# EAGLE design axiom_beta_shield_debug (EAGLE 7.7.0)
Assembly variants: Beta
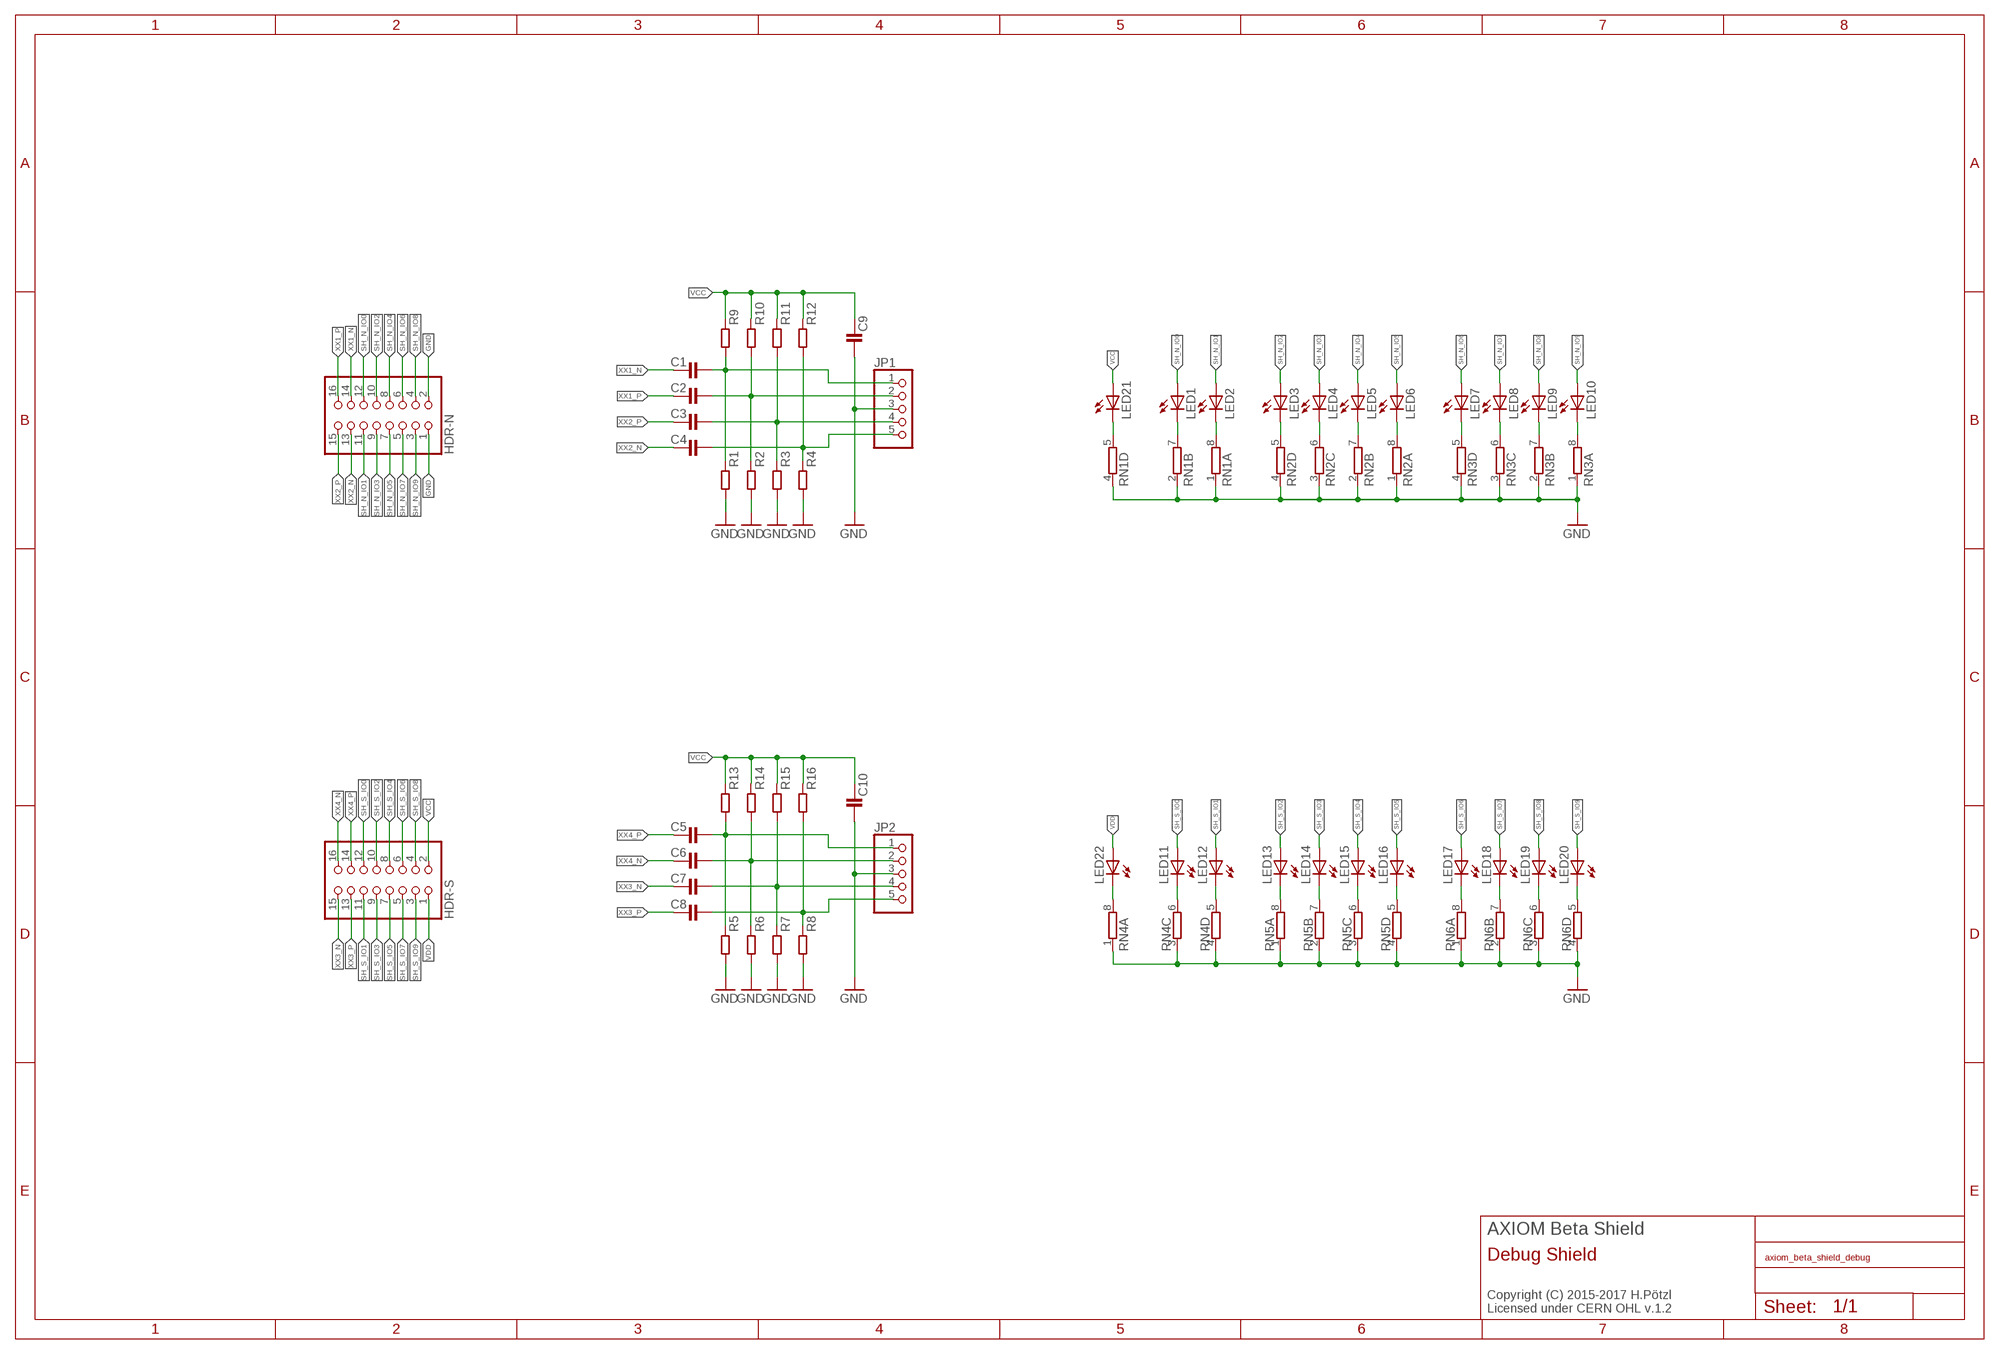
[diagram p0: schematic, sheet 1]

## Parts
C1  C0402-C  [0402-C]
C2  C0402-C  [0402-C]
C3  C0402-C  [0402-C]
C4  C0402-C  [0402-C]
C5  C0402-C  [0402-C]
C6  C0402-C  [0402-C]
C7  C0402-C  [0402-C]
C8  C0402-C  [0402-C]
C9  C0805-C  [0805-C]  (not fitted in variant Beta)
C10  C0805-C  [0805-C]  (not fitted in variant Beta)
HDR-N  PINHD-2X08_2.00_SMD  [2X08M_SMD]  (not fitted in variant Beta)
HDR-S  PINHD-2X08_2.00_SMD  [2X08M_SMD]  (not fitted in variant Beta)
JP1  PINHD-1X05_1.27  [1X05U]  (not fitted in variant Beta)
JP2  PINHD-1X05_1.27  [1X05U]  (not fitted in variant Beta)
LED1  LEDCHIPLED_0603  [CHIPLED_0603]
LED2  LEDCHIPLED_0603  [CHIPLED_0603]
LED3  LEDCHIPLED_0603  [CHIPLED_0603]
LED4  LEDCHIPLED_0603  [CHIPLED_0603]
LED5  LEDCHIPLED_0603  [CHIPLED_0603]
LED6  LEDCHIPLED_0603  [CHIPLED_0603]
LED7  LEDCHIPLED_0603  [CHIPLED_0603]
LED8  LEDCHIPLED_0603  [CHIPLED_0603]
LED9  LEDCHIPLED_0603  [CHIPLED_0603]
LED10  LEDCHIPLED_0603  [CHIPLED_0603]
LED11  LEDCHIPLED_0603  [CHIPLED_0603]
LED12  LEDCHIPLED_0603  [CHIPLED_0603]
LED13  LEDCHIPLED_0603  [CHIPLED_0603]
LED14  LEDCHIPLED_0603  [CHIPLED_0603]
LED15  LEDCHIPLED_0603  [CHIPLED_0603]
LED16  LEDCHIPLED_0603  [CHIPLED_0603]
LED17  LEDCHIPLED_0603  [CHIPLED_0603]
LED18  LEDCHIPLED_0603  [CHIPLED_0603]
LED19  LEDCHIPLED_0603  [CHIPLED_0603]
LED20  LEDCHIPLED_0603  [CHIPLED_0603]
LED21  LEDCHIPLED_0603  [CHIPLED_0603]
LED22  LEDCHIPLED_0603  [CHIPLED_0603]
R1  R0402-C  [0402-C]  (not fitted in variant Beta)
R2  R0402-C  [0402-C]  (not fitted in variant Beta)
R3  R0402-C  [0402-C]  (not fitted in variant Beta)
R4  R0402-C  [0402-C]  (not fitted in variant Beta)
R5  R0402-C  [0402-C]  (not fitted in variant Beta)
R6  R0402-C  [0402-C]  (not fitted in variant Beta)
R7  R0402-C  [0402-C]  (not fitted in variant Beta)
R8  R0402-C  [0402-C]  (not fitted in variant Beta)
R9  R0402-C  [0402-C]  (not fitted in variant Beta)
R10  R0402-C  [0402-C]  (not fitted in variant Beta)
R11  R0402-C  [0402-C]  (not fitted in variant Beta)
R12  R0402-C  [0402-C]  (not fitted in variant Beta)
R13  R0402-C  [0402-C]  (not fitted in variant Beta)
R14  R0402-C  [0402-C]  (not fitted in variant Beta)
R15  R0402-C  [0402-C]  (not fitted in variant Beta)
R16  R0402-C  [0402-C]  (not fitted in variant Beta)
RN1  4R-NCAY16  [CAY16]
RN2  4R-NCAY16  [CAY16]
RN3  4R-NCAY16  [CAY16]
RN4  4R-NCAY16  [CAY16]
RN5  4R-NCAY16  [CAY16]
RN6  4R-NCAY16  [CAY16]

## Nets
GND: C9.2 C10.2 HDR-N.1 HDR-N.2 JP1.3 JP2.3 R1.2 R2.2 R3.2 R4.2 R5.2 R6.2 R7.2 R8.2 RN1.1 RN1.2 RN1.4 RN2.1 RN2.2 RN2.3 RN2.4 RN3.1 RN3.2 RN3.3 RN3.4 RN4.1 RN4.3 RN4.4 RN5.1 RN5.2 RN5.3 RN5.4 RN6.1 RN6.2 RN6.3 RN6.4
N$1: LED20.C RN6.5
N$2: LED19.C RN6.6
N$3: LED18.C RN6.7
N$4: LED17.C RN6.8
N$5: LED16.C RN5.5
N$6: LED15.C RN5.6
N$7: LED14.C RN5.7
N$8: LED13.C RN5.8
N$9: LED12.C RN4.5
N$10: LED11.C RN4.6
N$11: LED3.C RN2.5
N$12: LED4.C RN2.6
N$13: LED5.C RN2.7
N$14: LED6.C RN2.8
N$15: LED7.C RN3.5
N$16: LED8.C RN3.6
N$17: LED9.C RN3.7
N$18: LED10.C RN3.8
N$19: LED1.C RN1.7
N$20: LED2.C RN1.8
N$22: C1.2 JP1.1 R1.1 R9.2
N$23: C2.2 JP1.2 R2.1 R10.2
N$24: C3.2 JP1.4 R3.1 R11.2
N$25: C4.2 JP1.5 R4.1 R12.2
N$26: C5.2 JP2.1 R5.1 R13.2
N$27: C6.2 JP2.2 R6.1 R14.2
N$28: LED21.C RN1.5
N$29: C7.2 JP2.4 R7.1 R15.2
N$30: C8.2 JP2.5 R8.1 R16.2
N$31: LED22.C RN4.8
SH_N_IO0: HDR-N.12 LED1.A
SH_N_IO1: HDR-N.11 LED2.A
SH_N_IO2: HDR-N.10 LED3.A
SH_N_IO3: HDR-N.9 LED4.A
SH_N_IO4: HDR-N.8 LED5.A
SH_N_IO5: HDR-N.7 LED6.A
SH_N_IO6: HDR-N.6 LED7.A
SH_N_IO7: HDR-N.5 LED8.A
SH_N_IO8: HDR-N.4 LED9.A
SH_N_IO9: HDR-N.3 LED10.A
SH_S_IO0: HDR-S.12 LED11.A
SH_S_IO1: HDR-S.11 LED12.A
SH_S_IO2: HDR-S.10 LED13.A
SH_S_IO3: HDR-S.9 LED14.A
SH_S_IO4: HDR-S.8 LED15.A
SH_S_IO5: HDR-S.7 LED16.A
SH_S_IO6: HDR-S.6 LED17.A
SH_S_IO7: HDR-S.5 LED18.A
SH_S_IO8: HDR-S.4 LED19.A
SH_S_IO9: HDR-S.3 LED20.A
VCC: C9.1 C10.1 HDR-S.2 LED21.A R9.1 R10.1 R11.1 R12.1 R13.1 R14.1 R15.1 R16.1
VDD: HDR-S.1 LED22.A
XX1_N: C1.1 HDR-N.14
XX1_P: C2.1 HDR-N.16
XX2_N: C4.1 HDR-N.13
XX2_P: C3.1 HDR-N.15
XX3_N: C7.1 HDR-S.15
XX3_P: C8.1 HDR-S.13
XX4_N: C6.1 HDR-S.16
XX4_P: C5.1 HDR-S.14
Unconnected: RN1.3 RN1.6 RN4.2 RN4.7

## Notes on the sheet
- AXIOM Beta Shield
- Debug Shield
- Copyright (C) 2015-2017 H.Pötzl
  Licensed under CERN OHL v.1.2

## Library data of the parts
C1-C10 = generic-rcl:C
HDR-N HDR-S = pincon:PINHD-2X08: PIN HEADER
JP1 JP2 = pinhead-2:PINHD-1X05: PIN HEADER
LED1-LED22 = led:LED: LED OSRAM: - CHIPLED LG R971, LG N971, LY N971, LG Q971, LY Q971, LO R971, LY R971 LH N974, LH R974 LS Q976, LO Q976, LY Q976 LO Q996 - Hyper CHIPLED LW Q18S LB Q993, LB Q99A, LB R99A - SideLED LS A670, LO A670, LY A670, LG A670, LP A670 LB A673, LV A673, LT A673, LW A673 LH A674 LY A675 LS A676, LA A676, LO A676, LY A676, LW A676 LS A679, LY A679, LG A679 - Hyper Micro SIDELED® LS Y876, LA Y876, LO Y876, LY Y876 LT Y87S - SmartLED LW L88C, LW L88S LB L89C, LB L89S, LG L890 LS L89K, LO L89K, LY L89K LS L896, LA L896, LO L896, LY L896 - TOPLED LS T670, LO T670, LY T670, LG T670, LP T670 LSG T670, LSP T670, LSY T670, LOP T670, LYG T670 LG T671, LOG T671, LSG T671 LB T673, LV T673, LT T673, LW T673 LH T674 LS T676, LA T676, LO T676, LY T676, LB T676, LH T676, LSB T676, LW T676 LB T67C, LV T67C, LT T67C, LS T67K, LO T67K, LY T67K, LW E67C LS E67B, LA E67B, LO E67B, LY E67B, LB E67C, LV E67C, LT E67C LW T67C LS T679, LY T679, LG T679 LS T770, LO T770, LY T770, LG T770, LP T770 LB T773, LV T773, LT T773, LW T773 LH T774 LS E675, LA E675, LY E675, LS T675 LS T776, LA T776, LO T776, LY T776, LB T776 LHGB T686 LT T68C, LB T68C - Hyper Mini TOPLED® LB M676 - Mini TOPLED Santana® LG M470 LS M47K, LO M47K, LY M47K Source: http://www.osram.convergy.de LUXEON: - LUMILED® LXK2-PW12-R00, LXK2-PW12-S00, LXK2-PW14-U00, LXK2-PW14-V00 LXK2-PM12-R00, LXK2-PM12-S00, LXK2-PM14-U00 LXK2-PE12-Q00, LXK2-PE12-R00, LXK2-PE12-S00, LXK2-PE14-T00, LXK2-PE14-U00 LXK2-PB12-K00, LXK2-PB12-L00, LXK2-PB12-M00, LXK2-PB14-N00, LXK2-PB14-P00, LXK2-PB14-Q00 LXK2-PR12-L00, LXK2-PR12-M00, LXK2-PR14-Q00, LXK2-PR14-R00 LXK2-PD12-Q00, LXK2-PD12-R00, LXK2-PD12-S00 LXK2-PH12-R00, LXK2-PH12-S00 LXK2-PL12-P00, LXK2-PL12-Q00, LXK2-PL12-R00 Source: www.luxeon.com KINGBRIGHT: KA-3528ASYC Source: www.kingbright.com
R1-R16 = generic-rcl:R
RN1-RN6 = resistor-dil:4R-N: Array Chip Resistor Source: RS Component / Phycomp; OC_FARNELL: unknown; OC_NEWARK: unknown

## Net classes
0 default: width 0.152 mm, drill 0.254 mm
1 power: width 0.152 mm, drill 0.254 mm

## Board
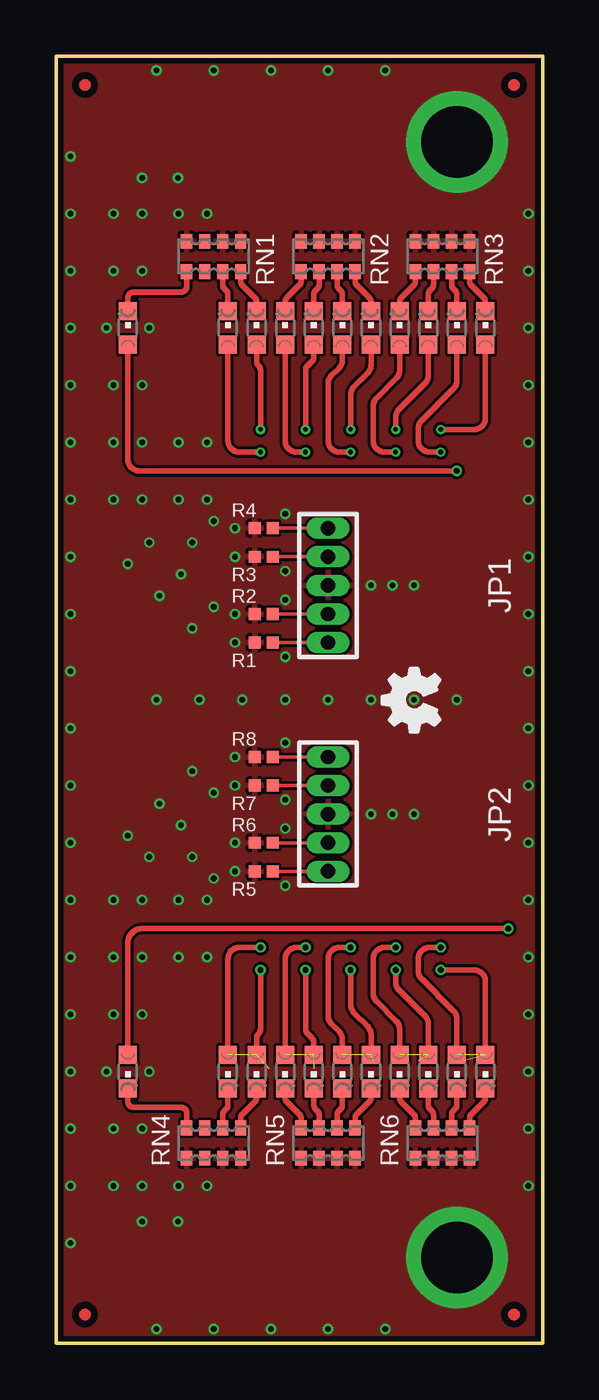
[diagram p1: board, top side]
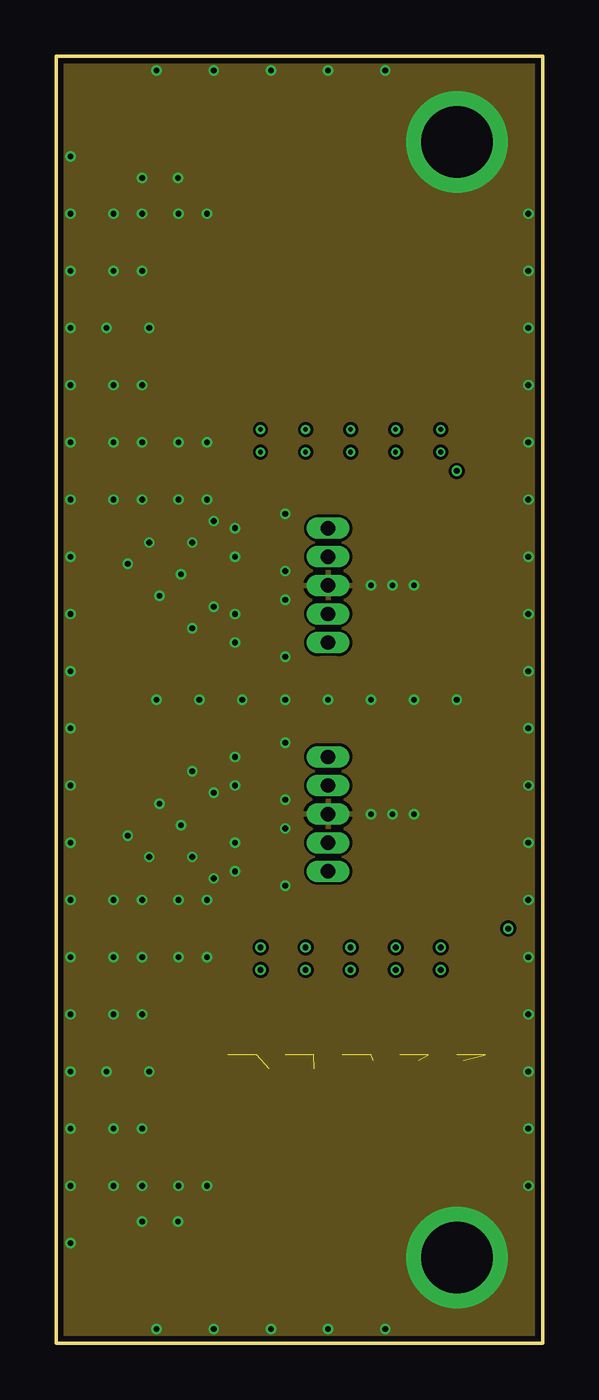
[diagram p2: board, inner layer Route2]
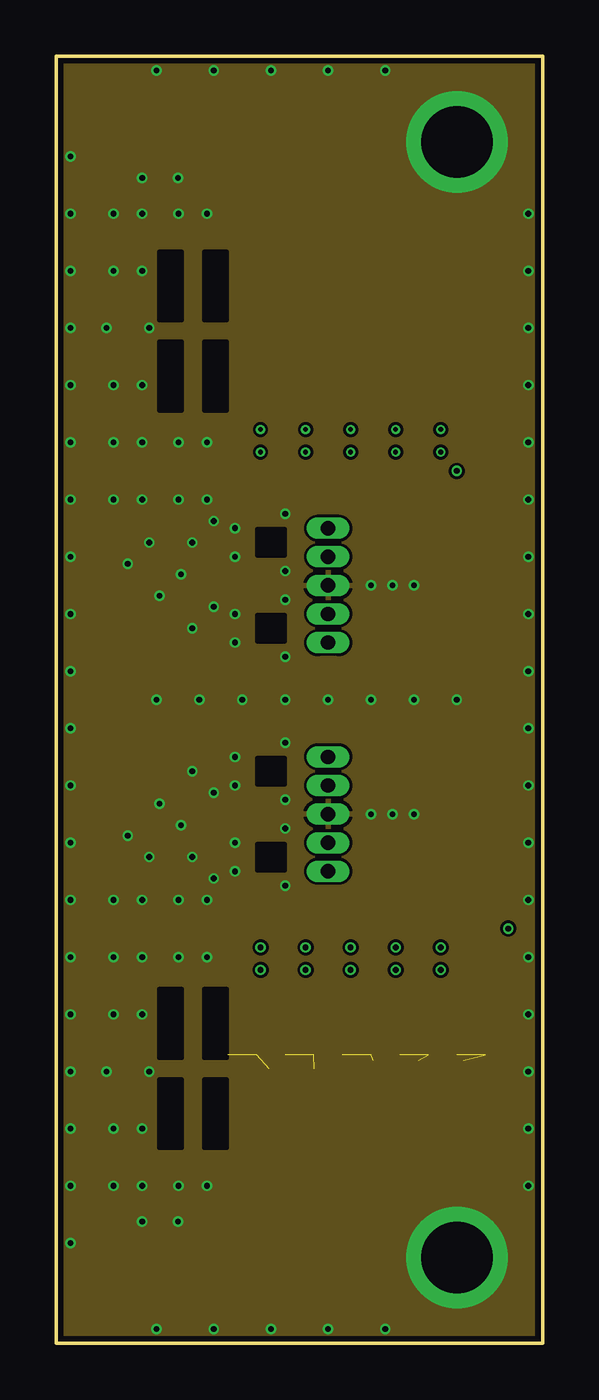
[diagram p3: board, inner layer Route15]
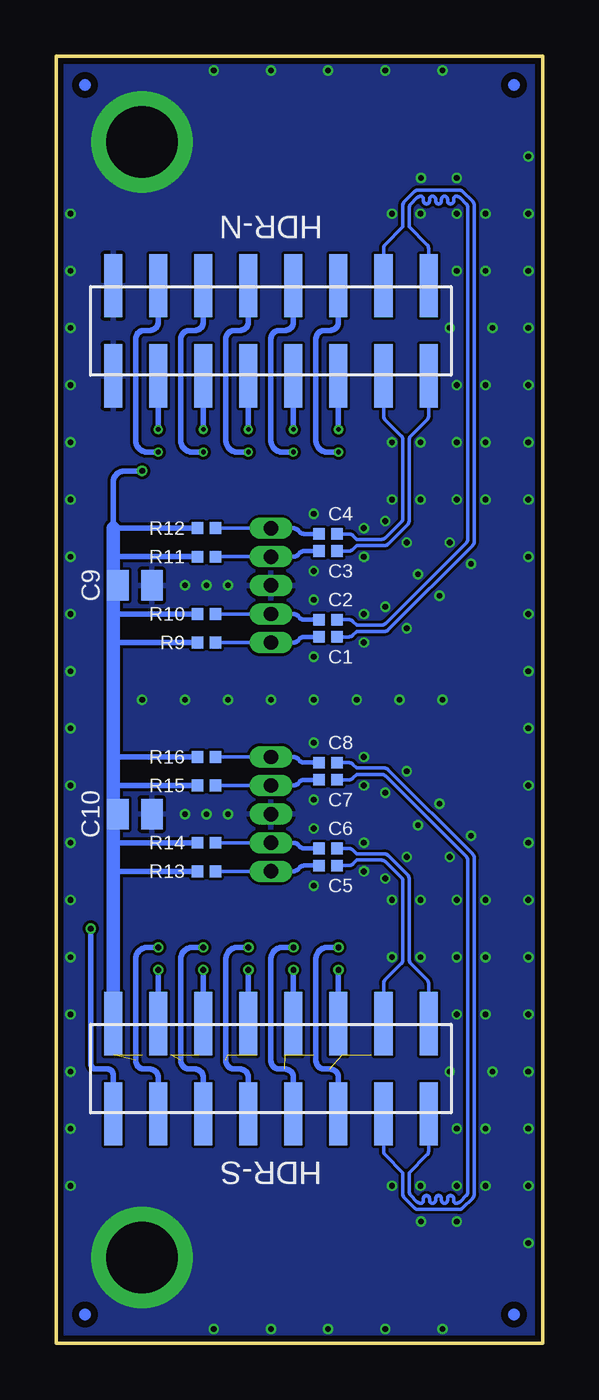
[diagram p4: board, bottom side, seen from below]

Size 21.59 x 57.15 mm. Coordinates in mm from the lower left corner, seen from the top.
Outline: 21.59,57.15 0,57.15 0,0 21.59,0 21.59,57.15
Copper layers (1*2*15*16): Top 0.035559375mm / dielectric 0.17018125mm / Route2 0.01778125mm / dielectric 47mil / Route15 0.01778125mm / dielectric 0.17018125mm / Bottom 0.035559375mm
Design rules "OSHPark-4layer-tuned *": minimum track width 5mil, minimum drill 10mil, track to track 5mil, track to pad 5mil, pad to pad 5mil, via to via 5mil, smd to smd 0mil, copper to edge 10mil, drill to drill 6mil, minimum pad ring 4mil, minimum via ring 4mil, stop-mask expansion 2mil, vias tented up to drill 50mil, thermal gap 6mil
tKeepout: area 15.3,50.8 to 20.3,55.8; area 15.3,1.3 to 20.3,6.3
bKeepout: area 15.3,50.8 to 20.3,55.8; area 15.3,1.3 to 20.3,6.3
tRestrict: area 19.8,0.7 to 20.9,1.8; area 19.8,55.3 to 20.9,56.4; area 0.7,55.3 to 1.8,56.4; area 0.7,0.7 to 1.8,1.8
bRestrict: area 19.8,0.7 to 20.9,1.8; area 19.8,55.3 to 20.9,56.4; area 0.7,55.3 to 1.8,56.4; area 0.7,0.7 to 1.8,1.8

### Footprints (pad centres in the part's own frame; a part is rotated, then mirrored left to right if it is on the bottom)
0402-C = smd 0.52 x 0.52: 1 -0.4,0; 2 0.4,0
0805-C = smd 0.95 x 1.35: 1 -0.75,0; 2 0.75,0
2X08M_SMD = smd 0.8 x 2.8: 1 -7,-2; 2 -7,2; 3 -5,-2; 4 -5,2; 5 -3,-2; 6 -3,2; 7 -1,-2; 8 -1,2; 9 1,-2; 10 1,2; 11 3,-2; 12 3,2; 13 5,-2; 14 5,2; 15 7,-2; 16 7,2
1X05U = drill 0.635 long: 1 -2.54,0; 2 -1.27,0; 3 0,0; 4 1.27,0; 5 2.54,0
CHIPLED_0603 = smd 0.8 x 0.8: A 0,-0.75; C 0,0.75
CAY16 = smd 0.5 x 0.65: 1 -1.2,-0.675; 2 -0.4,-0.675; 3 0.4,-0.675; 4 1.2,-0.675; 5 1.2,0.675; 6 0.4,0.675; 7 -0.4,0.675; 8 -1.2,0.675

### Placement (x,y rotation side)
C1  9.52,31.37 180 bottom
C2  9.52,32.13 180 bottom
C3  9.52,35.18 180 bottom
C4  9.52,35.94 180 bottom
C5  9.52,21.21 180 bottom
C6  9.52,21.97 180 bottom
C7  9.52,25.02 180 bottom
C8  9.52,25.78 180 bottom
C9  18.1,33.66 0 bottom  (not fitted)
C10  18.1,23.49 0 bottom  (not fitted)
HDR-N  12.06,44.96 0 bottom  (not fitted)
HDR-S  12.06,12.19 0 bottom  (not fitted)
JP1  12.06,33.66 90 top  (not fitted)
JP2  12.06,23.49 90 top  (not fitted)
LED1  7.62,45.09 0 top
LED2  8.89,45.09 0 top
LED3  10.16,45.09 0 top
LED4  11.43,45.09 0 top
LED5  12.7,45.09 0 top
LED6  13.97,45.09 0 top
LED7  15.24,45.09 0 top
LED8  16.51,45.09 0 top
LED9  17.78,45.09 0 top
LED10  19.05,45.09 0 top
LED11  7.62,12.06 180 top
LED12  8.89,12.06 180 top
LED13  10.16,12.06 180 top
LED14  11.43,12.06 180 top
LED15  12.7,12.06 180 top
LED16  13.97,12.06 180 top
LED17  15.24,12.06 180 top
LED18  16.51,12.06 180 top
LED19  17.78,12.06 180 top
LED20  19.05,12.06 180 top
LED21  3.17,45.09 0 top
LED22  3.17,12.06 180 top
LOGO1  OSHW_LOGO_FILLX0100-NT  [OSHW_FILLX100_NOTEXT]  17.02,27.15 90 top
R1  9.21,31.11 180 top  (not fitted)
R2  9.21,32.38 180 top  (not fitted)
R3  9.21,34.92 180 top  (not fitted)
R4  9.21,36.2 180 top  (not fitted)
R5  9.21,20.95 180 top  (not fitted)
R6  9.21,22.23 180 top  (not fitted)
R7  9.21,24.77 180 top  (not fitted)
R8  9.21,26.04 180 top  (not fitted)
R9  14.92,31.11 0 bottom  (not fitted)
R10  14.92,32.38 0 bottom  (not fitted)
R11  14.92,34.92 0 bottom  (not fitted)
R12  14.92,36.2 0 bottom  (not fitted)
R13  14.92,20.95 0 bottom  (not fitted)
R14  14.92,22.23 0 bottom  (not fitted)
R15  14.92,24.77 0 bottom  (not fitted)
R16  14.92,26.04 0 bottom  (not fitted)
RN1  6.98,48.26 180 top
RN2  12.06,48.26 180 top
RN3  17.14,48.26 180 top
RN4  6.98,8.89 0 top
RN5  12.06,8.89 0 top
RN6  17.14,8.89 0 top

### Tracks (layer width: path | path; a pad name or v marks a point on that pad's centre or on a via)
GND  (via drill 0.25, 3.17 pad 4.5)
  other vias: 17.78,3.81 17.78,53.34 20.95,50.16 20.95,47.62 20.95,45.09 20.95,42.55 20.95,40 20.95,37.47 20.95,34.92 20.95,32.38 20.95,29.84 20.95,27.3 20.95,24.77 20.95,22.23 20.95,19.68 20.95,17.14 20.95,14.6 20.95,12.06 20.95,9.52 20.95,6.98 14.61,0.63 12.06,0.63 9.52,0.63 6.98,0.63 4.44,0.63 0.63,6.98 0.63,9.52 0.63,12.06 0.63,14.6 0.63,17.14 0.63,19.68 0.63,22.23 0.63,24.77 0.63,27.3 0.63,29.84 0.63,32.38 0.63,34.92 0.63,37.47 0.63,40 0.63,42.55 0.63,45.09 0.63,47.62 0.63,50.16 0.63,52.7 0.63,4.45 14.61,56.52 12.06,56.52 9.52,56.52 6.98,56.52 4.44,56.52 10.16,33.02 10.16,30.48 10.16,36.83 10.16,26.67 10.16,24.13 10.16,22.86 10.16,20.32 10.16,34.29 2.54,50.16 2.54,47.62 3.81,50.16 4.13,45.09 3.81,37.47 2.22,45.09 2.54,42.55 2.54,40 3.81,47.62 3.81,42.55 3.81,40 2.54,37.47 3.17,34.61 4.13,35.56 5.42,37.47 6.03,35.56 6.98,36.51 6.69,37.47 5.42,40 6.69,40 7.94,34.92 7.94,36.2 7.94,32.38 7.94,31.11 6.98,32.7 6.03,31.75 4.58,33.2 5.54,34.15 3.81,51.75 5.4,51.75 5.42,50.16 6.69,50.16 2.54,6.98 2.54,9.52 3.81,6.98 4.13,12.06 3.81,19.68 2.22,12.06 2.54,14.6 2.54,17.14 3.81,9.52 3.81,14.6 3.81,17.14 2.54,19.68 3.17,22.54 4.13,21.59 5.42,19.68 6.03,21.59 6.98,20.64 6.69,19.68 5.42,17.14 6.69,17.14 7.94,22.23 7.94,20.95 7.94,24.77 7.94,26.04 6.98,24.45 6.03,25.4 4.58,23.95 5.54,23 3.81,5.4 5.4,5.4 5.42,6.98 6.69,6.98 13.97,33.66 15.88,33.66 10.16,28.57 13.97,28.57 12.06,28.57 8.25,28.57 6.35,28.57 4.44,28.57 15.88,28.57 17.78,28.57 14.92,33.66 13.97,23.49 15.88,23.49 14.92,23.49
  pour Top (rank 3): 21.59,0 0,0 0,57.15 21.59,57.15
  pour Bottom (rank 3): 21.59,0 0,0 0,57.15 21.59,57.15
  pour Route2 (rank 3): 21.59,0 0,0 0,57.15 21.59,57.15
  pour Route15 (rank 3): 21.59,0 0,0 0,57.15 21.59,57.15
N$1
  Top 0.254: LED20.C 19.05,10.9 arc-45 18.98,10.72 18.42,10.16 arc45 18.34,9.98 RN6.5
N$2
  Top 0.254: LED19.C 17.78,10.58 arc-45 17.71,10.4 17.62,10.32 arc45 17.55,10.14 RN6.6
N$3
  Top 0.254: LED18.C 16.51,10.58 arc45 16.58,10.4 16.67,10.32 arc-45 16.74,10.14 RN6.7
N$4
  Top 0.254: LED17.C 15.24,10.9 arc45 15.31,10.72 15.87,10.16 arc-45 15.95,9.98 RN6.8
N$5
  Top 0.254: LED16.C 13.97,10.9 arc-45 13.9,10.72 13.34,10.16 arc45 13.26,9.98 RN5.5
N$6
  Top 0.254: LED15.C 12.7,10.58 arc-45 12.63,10.4 12.54,10.32 arc45 12.46,10.14 RN5.6
N$7
  Top 0.254: LED14.C 11.43,10.58 arc45 11.5,10.4 11.59,10.32 arc-45 11.66,10.14 RN5.7
N$8
  Top 0.254: LED13.C 10.16,10.9 arc45 10.23,10.72 10.79,10.16 arc-45 10.87,9.98 RN5.8
N$9
  Top 0.254: LED12.C 8.89,10.9 arc-45 8.82,10.72 8.26,10.16 arc45 8.18,9.98 RN4.5
N$10
  Top 0.254: LED11.C 7.62,10.58 arc-45 7.55,10.4 7.46,10.32 arc45 7.38,10.14 RN4.6
N$11
  Top 0.254: LED3.C 10.16,46.25 arc-45 10.23,46.43 10.79,46.99 arc45 10.87,47.16 RN2.5
N$12
  Top 0.254: LED4.C 11.43,46.57 arc-45 11.5,46.75 11.59,46.83 arc45 11.66,47.01 RN2.6
N$13
  Top 0.254: LED5.C 12.7,46.57 arc45 12.63,46.75 12.54,46.83 arc-45 12.46,47.01 RN2.7
N$14
  Top 0.254: LED6.C 13.97,46.25 arc45 13.9,46.43 13.34,46.99 arc-45 13.26,47.16 RN2.8
N$15
  Top 0.254: LED7.C 15.24,46.25 arc-45 15.31,46.43 15.87,46.99 arc45 15.95,47.16 RN3.5
N$16
  Top 0.254: LED8.C 16.51,46.57 arc-45 16.58,46.75 16.67,46.83 arc45 16.74,47.01 RN3.6
N$17
  Top 0.254: LED9.C 17.78,46.57 arc45 17.71,46.75 17.62,46.83 arc-45 17.55,47.01 RN3.7
N$18
  Top 0.254: LED10.C 19.05,46.25 arc45 18.98,46.43 18.42,46.99 arc-45 18.34,47.16 RN3.8
N$19
  Top 0.254: LED1.C 7.62,46.57 arc45 7.55,46.75 7.46,46.83 arc-45 7.38,47.01 RN1.7
N$20
  Top 0.254: LED2.C 8.89,46.25 arc45 8.82,46.43 8.26,46.99 arc-45 8.18,47.16 RN1.8
N$21
  cutout Route15: 4.56,15.72 5.56,15.72 5.56,12.67 4.56,12.67
  cutout Route15: 6.56,15.72 7.56,15.72 7.56,12.67 6.56,12.67
  cutout Route15: 6.56,11.72 7.56,11.72 7.56,8.68 6.56,8.68
  cutout Route15: 4.56,11.72 5.56,11.72 5.56,8.68 4.56,8.68
  cutout Route15: 5.56,45.42 4.56,45.42 4.56,48.47 5.56,48.47
  cutout Route15: 7.56,45.42 6.56,45.42 6.56,48.47 7.56,48.47
  cutout Route15: 7.56,41.42 6.56,41.42 6.56,44.48 7.56,44.48
  cutout Route15: 5.56,41.42 4.56,41.42 4.56,44.48 5.56,44.48
  cutout Route15: 10.13,36.15 10.13,34.97 8.92,34.97 8.92,36.15
  cutout Route15: 10.13,32.34 10.13,31.16 8.92,31.16 8.92,32.34
  cutout Route15: 10.13,25.99 10.13,24.81 8.92,24.81 8.92,25.99
  cutout Route15: 10.13,22.18 10.13,21 8.92,21 8.92,22.18
N$22
  Top 0.152: R1.1 JP1.1
  Bottom 0.152: R9.2 JP1.1
  Bottom 0.203: C1.2 10.59,31.37 arc-45 10.77,31.29 10.86,31.21 arc45 11.08,31.11 JP1.1
N$23
  Top 0.152: R2.1 JP1.2
  Bottom 0.152: R10.2 JP1.2
  Bottom 0.203: C2.2 10.59,32.13 arc45 10.77,32.2 10.86,32.29 arc-45 11.08,32.38 JP1.2
N$24
  Top 0.152: R3.1 JP1.4
  Bottom 0.152: R11.2 JP1.4
  Bottom 0.203: C3.2 10.59,35.18 arc-45 10.77,35.1 10.86,35.02 arc45 11.08,34.92 JP1.4
N$25
  Top 0.152: R4.1 JP1.5
  Bottom 0.152: R12.2 JP1.5
  Bottom 0.203: C4.2 10.59,35.94 arc45 10.77,36.02 10.86,36.1 arc-45 11.08,36.2 JP1.5
N$26
  Top 0.152: R5.1 JP2.1
  Bottom 0.152: R13.2 JP2.1
  Bottom 0.203: C5.2 10.59,21.21 arc-45 10.77,21.13 10.86,21.05 arc45 11.08,20.95 JP2.1
N$27
  Top 0.152: R6.1 JP2.2
  Bottom 0.152: R14.2 JP2.2
  Bottom 0.203: C6.2 10.59,21.97 arc45 10.77,22.04 10.86,22.13 arc-45 11.08,22.23 JP2.2
N$28
  Top 0.254: LED21.C 3.17,46.42 arc-90 3.43,46.67 5.53,46.67 arc90 5.78,46.93 RN1.5
N$29
  Top 0.152: R7.1 JP2.4
  Bottom 0.152: R15.2 JP2.4
  Bottom 0.203: C7.2 10.59,25.02 arc-45 10.77,24.95 10.86,24.86 arc45 11.08,24.77 JP2.4
N$30
  Top 0.152: R8.1 JP2.5
  Bottom 0.152: R16.2 JP2.5
  Bottom 0.203: C8.2 10.59,25.78 arc45 10.77,25.86 10.86,25.94 arc-45 11.08,26.04 JP2.5
N$31
  Top 0.254: LED22.C 3.17,10.73 arc90 3.43,10.48 5.53,10.48 arc-90 5.78,10.22 RN4.8
SH_N_IO0  (via drill 0.2)
  Top 0.254: v9.06,39.58 8.13,39.58 arc-90 7.62,40.08 LED1.A
  Bottom 0.254: HDR-N.12 9.06,45.36 arc90 9.45,44.97 9.68,44.97 arc-90 10.06,44.59 10.06,40.08 arc-90 9.56,39.58 v9.06,39.58
SH_N_IO1  (via drill 0.2)
  Top 0.254: v9.06,40.58 9.06,43.22 arc45 8.99,43.4 8.96,43.43 arc-45 8.89,43.6 LED2.A
  Bottom 0.254: HDR-N.11 v9.06,40.58
SH_N_IO2  (via drill 0.2)
  Top 0.254: v11.06,39.58 10.67,39.58 arc-90 10.16,40.09 LED3.A
  Bottom 0.254: HDR-N.10 11.06,45.36 arc90 11.45,44.97 11.68,44.97 arc-90 12.06,44.59 12.06,40.08 arc-90 11.56,39.58 v11.06,39.58
SH_N_IO3  (via drill 0.2)
  Top 0.254: v11.06,40.58 11.06,43.22 arc-45 11.14,43.4 11.36,43.62 arc45 11.43,43.8 LED4.A
  Bottom 0.254: HDR-N.9 v11.06,40.58
SH_N_IO4  (via drill 0.2)
  Top 0.254: v13.06,39.58 12.58,39.58 arc-90 12.06,40.09 12.06,42.61 arc-45 12.21,42.98 12.55,43.31 arc45 12.7,43.67 LED5.A
  Bottom 0.254: HDR-N.8 13.06,45.36 arc90 13.45,44.97 13.68,44.97 arc-90 14.06,44.59 14.06,40.08 arc-90 13.56,39.58 v13.06,39.58
SH_N_IO5  (via drill 0.2)
  Top 0.254: v13.06,40.58 13.06,42.11 arc-45 13.21,42.48 13.82,43.08 arc45 13.97,43.44 LED6.A
  Bottom 0.254: HDR-N.7 v13.06,40.58
SH_N_IO6  (via drill 0.2)
  Top 0.254: v15.06,39.58 14.58,39.58 arc-90 14.06,40.09 14.06,41.61 arc-45 14.21,41.98 15.09,42.85 arc45 15.24,43.21 LED7.A
  Bottom 0.254: HDR-N.6 15.06,45.36 arc90 15.45,44.97 15.68,44.97 arc-90 16.06,44.59 16.06,40.08 arc-90 15.56,39.58 v15.06,39.58
SH_N_IO7  (via drill 0.2)
  Top 0.254: v15.06,40.58 15.06,41.11 arc-45 15.21,41.48 16.36,42.62 arc45 16.51,42.98 LED8.A
  Bottom 0.254: HDR-N.5 v15.06,40.58
SH_N_IO8  (via drill 0.2)
  Top 0.254: v17.06,39.58 16.58,39.58 arc-90 16.06,40.09 16.06,40.61 arc-45 16.21,40.98 17.63,42.39 arc45 17.78,42.75 LED9.A
  Bottom 0.254: HDR-N.4 17.06,45.36 arc90 17.45,44.97 17.68,44.97 arc-90 18.06,44.59 18.06,40.08 arc-90 17.56,39.58 v17.06,39.58
SH_N_IO9  (via drill 0.2)
  Top 0.254: LED10.A 19.05,41.08 arc-90 18.54,40.58 v17.06,40.58
  Bottom 0.254: HDR-N.3 v17.06,40.58
SH_S_IO0  (via drill 0.25)  (1 unrouted)
  Top 0.254: v9.06,16.57 9.06,13.93 arc-45 8.99,13.75 8.96,13.72 arc45 8.89,13.54 8.89,12.81
  Bottom 0.254: HDR-S.12 v9.06,16.57
SH_S_IO1  (via drill 0.25)  (1 unrouted)
  Top 0.254: v9.06,17.57 8.13,17.57 arc90 7.62,17.07 7.62,12.81
  Bottom 0.254: HDR-S.11 9.06,11.79 arc-90 9.45,12.18 9.68,12.18 arc90 10.06,12.56 10.06,17.07 arc90 9.56,17.57 v9.06,17.57
SH_S_IO2  (via drill 0.25)  (1 unrouted)
  Top 0.254: v11.06,16.57 11.06,13.93 arc45 11.14,13.75 11.36,13.53 arc-45 11.43,13.35 11.43,12.81
  Bottom 0.254: HDR-S.10 v11.06,16.57
SH_S_IO3  (via drill 0.25)  (1 unrouted)
  Top 0.254: v11.06,17.57 10.67,17.57 arc90 10.16,17.06 10.16,12.81
  Bottom 0.254: HDR-S.9 11.06,11.79 arc-90 11.45,12.18 11.68,12.18 arc90 12.06,12.56 12.06,17.07 arc90 11.56,17.57 v11.06,17.57
SH_S_IO4  (via drill 0.25)  (1 unrouted)
  Top 0.254: v13.06,16.57 13.06,15.04 arc45 13.21,14.67 13.82,14.07 arc-45 13.97,13.71 13.97,12.81
  Bottom 0.254: HDR-S.8 v13.06,16.57
SH_S_IO5  (via drill 0.25)  (1 unrouted)
  Top 0.254: v13.06,17.57 12.58,17.57 arc90 12.06,17.06 12.06,14.54 arc45 12.21,14.17 12.55,13.84 arc-45 12.7,13.48 12.7,12.81
  Bottom 0.254: HDR-S.7 13.06,11.79 arc-90 13.45,12.18 13.68,12.18 arc90 14.06,12.56 14.06,17.07 arc90 13.56,17.57 v13.06,17.57
SH_S_IO6  (via drill 0.25)  (1 unrouted)
  Top 0.254: v15.06,16.57 15.06,16.04 arc45 15.21,15.67 16.36,14.53 arc-45 16.51,14.17 16.51,12.81
  Bottom 0.254: HDR-S.6 v15.06,16.57
SH_S_IO7  (via drill 0.25)  (1 unrouted)
  Top 0.254: v15.06,17.57 14.58,17.57 arc90 14.06,17.06 14.06,15.54 arc45 14.21,15.17 15.09,14.3 arc-45 15.24,13.94 15.24,12.81
  Bottom 0.254: HDR-S.5 15.06,11.79 arc-90 15.45,12.18 15.68,12.18 arc90 16.06,12.56 16.06,17.07 arc90 15.56,17.57 v15.06,17.57
SH_S_IO8  (via drill 0.25)  (1 unrouted)
  Top 0.254: 19.05,12.81 19.05,16.07 arc90 18.54,16.57 v17.06,16.57
  Bottom 0.254: HDR-S.4 v17.06,16.57
SH_S_IO9  (via drill 0.25)  (1 unrouted)
  Top 0.254: v17.06,17.57 16.58,17.57 arc90 16.06,17.06 16.06,16.54 arc45 16.21,16.17 17.63,14.76 arc-45 17.78,14.4 17.78,12.81
  Bottom 0.254: HDR-S.3 17.06,11.79 arc-90 17.45,12.18 17.68,12.18 arc90 18.06,12.56 18.06,17.07 arc90 17.56,17.57 v17.06,17.57
VCC  (via drill 0.25)
  Top 0.254: v17.78,38.73 3.68,38.73 arc-90 3.17,39.24 LED21.A
  Bottom 0.254: v17.78,38.73 18.56,38.73 arc-90 19.06,38.23 19.06,36.2 R12.1 | R11.1 19.06,34.92 | R10.1 19.06,32.38 | R9.1 19.06,31.11 | R16.1 19.06,26.04 | R15.1 19.06,24.77 | R14.1 19.06,22.23 | R13.1 19.06,20.95
  Bottom 0.61: HDR-S.2 19.06,20.95 19.06,22.23 19.06,23.49 | 19.06,23.49 19.06,24.77 19.06,26.04 19.06,31.11 19.06,32.38 19.06,33.66 | 19.06,33.66 19.06,34.92 19.06,36.2 | C9.1 19.06,33.66 | C10.1 19.06,23.49
VDD  (via drill 0.25)
  Top 0.254: v20.06,18.41 3.81,18.41 arc90 3.17,17.78 LED22.A
  Bottom 0.254: HDR-S.1 19.06,11.92 arc-90 19.32,12.18 19.81,12.18 arc90 20.06,12.43 v20.06,18.41
XX1_N
  Bottom 0.152: C1.1 8.6,31.37 arc-45 8.42,31.44 8.25,31.61 7.03,31.61 arc-45 6.85,31.68 3.11,35.43 arc-45 3.04,35.61 3.04,50.53 arc-45 3.11,50.71 3.54,51.14 arc-45 3.72,51.22 5.52,51.22 arc-45 5.7,51.14 6.13,50.71 arc-45 6.2,50.53 6.2,49.58 6.99,48.79 arc-45 7.06,48.61 HDR-N.14
XX1_P
  Bottom 0.152: C2.1 8.6,32.13 arc45 8.42,32.06 8.25,31.89 7.15,31.89 arc-45 6.97,31.96 3.39,35.54 arc-45 3.31,35.72 3.31,50.41 arc-45 3.39,50.59 3.66,50.86 arc-45 3.84,50.94 arc-90 3.95,50.8 3.95,50.73 arc90 4.09,50.59 arc90 4.22,50.73 4.22,50.8 arc-90 4.36,50.94 4.35,50.94 arc-90 4.49,50.8 4.49,50.73 arc90 4.62,50.59 arc90 4.75,50.73 4.75,50.8 arc-90 4.89,50.94 arc-90 5.02,50.8 5.02,50.73 arc90 5.16,50.59 arc90 5.29,50.73 5.29,50.8 arc-90 5.41,50.94 arc-45 5.58,50.86 5.85,50.59 arc-45 5.92,50.41 5.92,49.58 5.14,48.79 arc45 5.06,48.61 HDR-N.16
XX2_N
  Bottom 0.152: C4.1 8.6,35.94 arc45 8.42,35.87 8.25,35.7 7.15,35.7 arc-45 6.97,35.77 6.28,36.46 arc-45 6.2,36.64 6.2,40.11 arc-45 6.28,40.29 6.99,41 arc45 7.06,41.18 HDR-N.13
XX2_P
  Bottom 0.152: C3.1 8.6,35.18 arc-45 8.42,35.25 8.25,35.42 7.03,35.42 arc-45 6.85,35.49 6,36.35 arc-45 5.92,36.53 5.92,40.11 arc45 5.85,40.29 5.14,41 arc-45 5.06,41.18 HDR-N.15
XX3_N
  Bottom 0.152: C7.1 8.6,25.02 arc-45 8.42,25.09 8.25,25.26 7.15,25.26 arc45 6.97,25.19 3.39,21.61 arc45 3.31,21.43 3.31,6.74 arc45 3.39,6.56 3.66,6.29 arc45 3.84,6.21 arc90 3.95,6.35 3.95,6.42 arc-90 4.09,6.56 arc-90 4.22,6.42 4.22,6.35 arc90 4.36,6.21 4.35,6.21 arc90 4.49,6.35 4.49,6.42 arc-90 4.62,6.56 arc-90 4.75,6.42 4.75,6.35 arc90 4.89,6.21 arc90 5.02,6.35 5.02,6.42 arc-90 5.16,6.56 arc-90 5.29,6.42 5.29,6.35 arc90 5.41,6.21 arc45 5.58,6.29 5.85,6.56 arc45 5.92,6.74 5.92,7.57 5.14,8.36 arc-45 5.06,8.54 HDR-S.15
XX3_P
  Bottom 0.152: C8.1 8.6,25.78 arc45 8.42,25.71 8.25,25.54 7.03,25.54 arc45 6.85,25.46 3.11,21.72 arc45 3.04,21.54 3.04,6.62 arc45 3.11,6.44 3.54,6.01 arc45 3.72,5.93 5.52,5.93 arc45 5.7,6.01 6.13,6.44 arc45 6.2,6.62 6.2,7.57 6.99,8.36 arc45 7.06,8.54 HDR-S.13
XX4_N
  Bottom 0.152: C6.1 8.6,21.97 arc45 8.42,21.9 8.25,21.73 7.03,21.73 arc45 6.85,21.66 6,20.8 arc45 5.92,20.62 5.92,17.04 arc-45 5.85,16.86 5.14,16.15 arc45 5.06,15.97 HDR-S.16
XX4_P
  Bottom 0.152: C5.1 8.6,21.21 arc-45 8.42,21.28 8.25,21.45 7.15,21.45 arc45 6.97,21.38 6.28,20.69 arc45 6.2,20.51 6.2,17.04 arc45 6.28,16.86 6.99,16.15 arc-45 7.06,15.97 HDR-S.14
(copper drawn outside any net)
  shapes: Bottom circle x4, Top circle x4

### Text on the board
_tSilk: Debug / Shield | Copyright (C) 2016-2017 H.Pötzl / Licensed under / CERN OHL v.1.2 | V0.2 / R1.0
tEngrave: AXIOM BETA DEBUG SHIELD / TOP SIDE V0.2 R1.0
bEngrave: AXIOM BETA DEBUG SHIELD / BOTTOM SIDE V0.2 R1.0